# Altium schematic sheet MainPCB.SchDoc
size A4; SheetNumber: 1; SheetTotal: 4
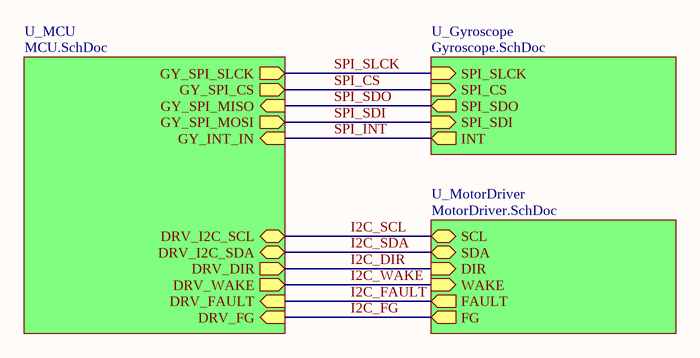
[diagram p0: MainPCB.SchDoc]

## Sub-sheets
U_Gyroscope = Gyroscope.SchDoc: SPI_SDI (in), SPI_SLCK (in), SPI_CS (in), SPI_SDO (out), INT (out)
U_MCU = MCU.SchDoc: GY_SPI_CS (out), GY_SPI_MISO (in), GY_SPI_MOSI (out), GY_SPI_SLCK (out), GY_INT_IN (in), DRV_I2C_SCL (bidir), DRV_I2C_SDA (bidir), DRV_WAKE (out), DRV_FAULT (in), DRV_DIR (out), DRV_FG (in)
U_MotorDriver = MotorDriver.SchDoc: SCL (bidir), SDA (bidir), DIR (in), FG (out), WAKE (in), FAULT (out)

## Nets
I2C_DIR: sheet U_MotorDriver/DIR, sheet U_MCU/DRV_DIR
I2C_FAULT: sheet U_MotorDriver/FAULT, sheet U_MCU/DRV_FAULT
I2C_FG: sheet U_MotorDriver/FG, sheet U_MCU/DRV_FG
I2C_SCL: sheet U_MotorDriver/SCL, sheet U_MCU/DRV_I2C_SCL
I2C_SDA: sheet U_MotorDriver/SDA, sheet U_MCU/DRV_I2C_SDA
I2C_WAKE: sheet U_MotorDriver/WAKE, sheet U_MCU/DRV_WAKE
SPI_CS: sheet U_Gyroscope/SPI_CS, sheet U_MCU/GY_SPI_CS
SPI_INT: sheet U_Gyroscope/INT, sheet U_MCU/GY_INT_IN
SPI_SDI: sheet U_Gyroscope/SPI_SDI, sheet U_MCU/GY_SPI_MOSI
SPI_SDO: sheet U_Gyroscope/SPI_SDO, sheet U_MCU/GY_SPI_MISO
SPI_SLCK: sheet U_Gyroscope/SPI_SLCK, sheet U_MCU/GY_SPI_SLCK